# Altium schematic sheet [4] - DRIVERS.SchDoc: Control Board
size A4; CheckedBy: Rafael Lang; CompanyName: Gear Labs; DrawnBy: Pedro Neves; Organization: Gear Labs; DocumentNumber: 001/2017; Revision: v1.0; SheetNumber: 4; SheetTotal: 6
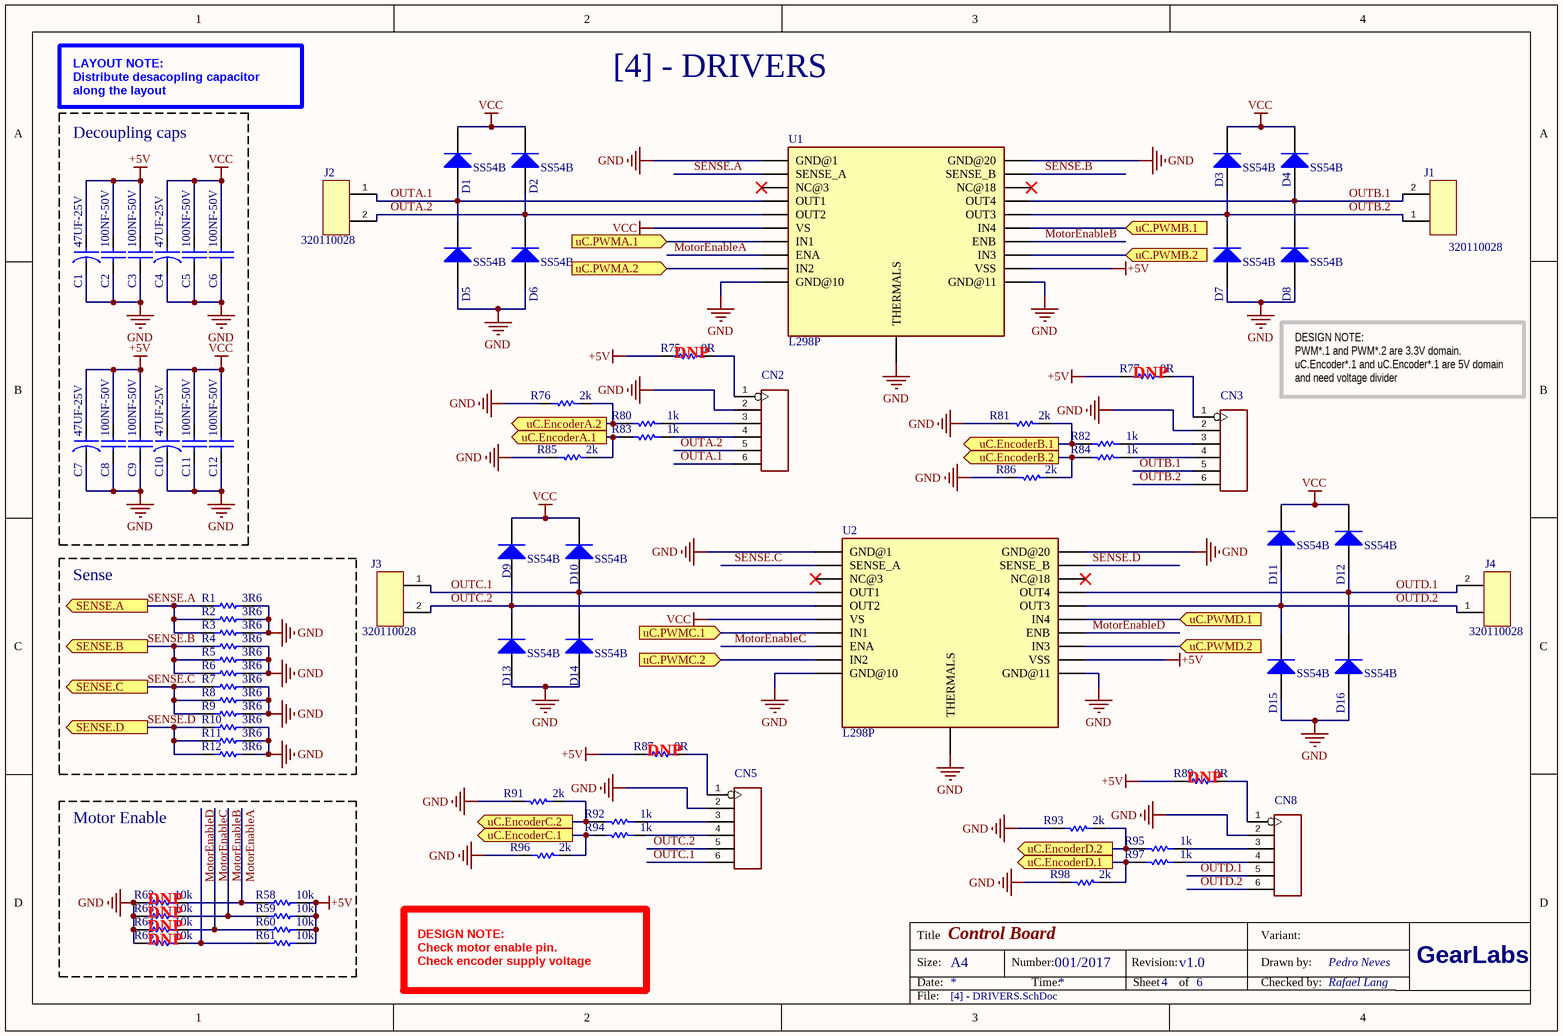
[diagram p0: [4] - DRIVERS.SchDoc]

## Parts
C1  value 47UF-25V  [ELECTRO-SMD-C-6MM]  (hidden comment: 302030059)
C2  value 100NF-50V  [C0603]  (hidden comment: 302010138)
C3  value 100NF-50V  [C0603]  (hidden comment: 302010138)
C4  value 47UF-25V  [ELECTRO-SMD-C-6MM]  (hidden comment: 302030059)
C5  value 100NF-50V  [C0603]  (hidden comment: 302010138)
C6  value 100NF-50V  [C0603]  (hidden comment: 302010138)
C7  value 47UF-25V  [ELECTRO-SMD-C-6MM]  (hidden comment: 302030059)
C8  value 100NF-50V  [C0603]  (hidden comment: 302010138)
C9  value 100NF-50V  [C0603]  (hidden comment: 302010138)
C10  value 47UF-25V  [ELECTRO-SMD-C-6MM]  (hidden comment: 302030059)
C11  value 100NF-50V  [C0603]  (hidden comment: 302010138)
C12  value 100NF-50V  [C0603]  (hidden comment: 302010138)
CN2  320030060  [H6-2.54]  (value not drawn)
CN3  320030060  [H6-2.54]  (value not drawn)
CN5  320030060  [H6-2.54]  (value not drawn)
CN8  320030060  [H6-2.54]  (value not drawn)
D1  MPN: SS54B  [DO-214AA]  (hidden comment: 304020021)
D2  MPN: SS54B  [DO-214AA]  (hidden comment: 304020021)
D3  MPN: SS54B  [DO-214AA]  (hidden comment: 304020021)
D4  MPN: SS54B  [DO-214AA]  (hidden comment: 304020021)
D5  MPN: SS54B  [DO-214AA]  (hidden comment: 304020021)
D6  MPN: SS54B  [DO-214AA]  (hidden comment: 304020021)
D7  MPN: SS54B  [DO-214AA]  (hidden comment: 304020021)
D8  MPN: SS54B  [DO-214AA]  (hidden comment: 304020021)
D9  MPN: SS54B  [DO-214AA]  (hidden comment: 304020021)
D10  MPN: SS54B  [DO-214AA]  (hidden comment: 304020021)
D11  MPN: SS54B  [DO-214AA]  (hidden comment: 304020021)
D12  MPN: SS54B  [DO-214AA]  (hidden comment: 304020021)
D13  MPN: SS54B  [DO-214AA]  (hidden comment: 304020021)
D14  MPN: SS54B  [DO-214AA]  (hidden comment: 304020021)
D15  MPN: SS54B  [DO-214AA]  (hidden comment: 304020021)
D16  MPN: SS54B  [DO-214AA]  (hidden comment: 304020021)
J1  320110028  [H2-3.5-7.0X7.0MM]
J2  320110028  [H2-3.5-7.0X7.0MM]
J3  320110028  [H2-3.5-7.0X7.0MM]
J4  320110028  [H2-3.5-7.0X7.0MM]
R1  value 3R6  [R0603]  (hidden comment: 301010140)
R2  value 3R6  [R0603]  (hidden comment: 301010140)
R3  value 3R6  [R0603]  (hidden comment: 301010140)
R4  value 3R6  [R0603]  (hidden comment: 301010140)
R5  value 3R6  [R0603]  (hidden comment: 301010140)
R6  value 3R6  [R0603]  (hidden comment: 301010140)
R7  value 3R6  [R0603]  (hidden comment: 301010140)
R8  value 3R6  [R0603]  (hidden comment: 301010140)
R9  value 3R6  [R0603]  (hidden comment: 301010140)
R10  value 3R6  [R0603]  (hidden comment: 301010140)
R11  value 3R6  [R0603]  (hidden comment: 301010140)
R12  value 3R6  [R0603]  (hidden comment: 301010140)
R58  value 10k  [R0603]  (hidden comment: 301010293)
R59  value 10k  [R0603]  (hidden comment: 301010293)
R60  value 10k  [R0603]  (hidden comment: 301010293)
R61  value 10k  [R0603]  (hidden comment: 301010293)
R62  value 10k  [R0603]  (hidden comment: 301010293)
R63  value 10k  [R0603]  (hidden comment: 301010293)
R64  value 10k  [R0603]  (hidden comment: 301010293)
R65  value 10k  [R0603]  (hidden comment: 301010293)
R75  value 0R  [R0603]  (hidden comment: 301010292)
R76  value 2k  [R0603]  (hidden comment: 301010221)
R77  value 0R  [R0603]  (hidden comment: 301010292)
R80  value 1k  [R0603]  (hidden comment: 301010298)
R81  value 2k  [R0603]  (hidden comment: 301010221)
R82  value 1k  [R0603]  (hidden comment: 301010298)
R83  value 1k  [R0603]  (hidden comment: 301010298)
R84  value 1k  [R0603]  (hidden comment: 301010298)
R85  value 2k  [R0603]  (hidden comment: 301010221)
R86  value 2k  [R0603]  (hidden comment: 301010221)
R87  value 0R  [R0603]  (hidden comment: 301010292)
R89  value 0R  [R0603]  (hidden comment: 301010292)
R91  value 2k  [R0603]  (hidden comment: 301010221)
R92  value 1k  [R0603]  (hidden comment: 301010298)
R93  value 2k  [R0603]  (hidden comment: 301010221)
R94  value 1k  [R0603]  (hidden comment: 301010298)
R95  value 1k  [R0603]  (hidden comment: 301010298)
R96  value 2k  [R0603]  (hidden comment: 301010221)
R97  value 1k  [R0603]  (hidden comment: 301010298)
R98  value 2k  [R0603]  (hidden comment: 301010221)
U1  L298P  [SOIC20G-1.27-16X11MM]
U2  L298P  [SOIC20G-1.27-16X11MM]

## Blocks framed on the sheet
Decoupling caps: C1-C12
Sense: R1-R12

## Ports
SENSE.A (out), SENSE.B (out), SENSE.C (out), SENSE.D (out), uC.EncoderA.1 (out), uC.EncoderA.2 (out), uC.EncoderB.1 (out), uC.EncoderB.2 (out), uC.EncoderC.1 (out), uC.EncoderC.2 (out), uC.EncoderD.1 (out), uC.EncoderD.2 (out), uC.PWMA.1 (in), uC.PWMA.2 (in), uC.PWMB.1 (in), uC.PWMB.2 (in), uC.PWMC.1 (in), uC.PWMC.2 (in), uC.PWMD.1 (in), uC.PWMD.2 (in)

## Nets
+5V: C1.+ C2.1 C3.1 C7.+ C8.1 C9.1 R58.2 R59.2 R60.2 R61.2 R75.1 R77.1 R87.1 R89.1 U1.12(VSS) U2.12(VSS)
GND: C1.- C2.2 C3.2 C4.- C5.2 C6.2 C7.- C8.2 C9.2 C10.- C11.2 C12.2 CN2.2 CN3.2 CN5.2 CN8.2 D5.+ D6.+ D7.+ D8.+ D13.+ D14.+ D15.+ D16.+ R1.2 R2.2 R3.2 R4.2 R5.2 R6.2 R7.2 R8.2 R9.2 R10.2 R11.2 R12.2 R62.1 R63.1 R64.1 R65.1 R76.1 R81.1 R85.1 R86.1 R91.1 R93.1 R96.1 R98.1 U1.1(GND@1) U1.10(GND@10) U1.11(GND@11) U1.20(GND@20) U1.THERMALS U2.1(GND@1) U2.10(GND@10) U2.11(GND@11) U2.20(GND@20) U2.THERMALS
VCC: C4.+ C5.1 C6.1 C10.+ C11.1 C12.1 D1.- D2.- D3.- D4.- D9.- D10.- D11.- D12.- U1.6(VS) U2.6(VS)
MotorEnableA: R58.1 R62.2 U1.8(ENA)
MotorEnableB: R59.1 R63.2 U1.14(ENB)
MotorEnableC: R60.1 R64.2 U2.8(ENA)
MotorEnableD: R61.1 R65.2 U2.14(ENB)
OUTA.1: CN2.6 D1.+ D5.- J2.1 U1.4(OUT1)
OUTA.2: CN2.5 D2.+ D6.- J2.2 U1.5(OUT2)
OUTB.1: CN3.5 D4.+ D8.- J1.2 U1.17(OUT4)
OUTB.2: CN3.6 D3.+ D7.- J1.1 U1.16(OUT3)
OUTC.1: CN5.6 D10.+ D14.- J3.1 U2.4(OUT1)
OUTC.2: CN5.5 D9.+ D13.- J3.2 U2.5(OUT2)
OUTD.1: CN8.5 D12.+ D16.- J4.2 U2.17(OUT4)
OUTD.2: CN8.6 D11.+ D15.- J4.1 U2.16(OUT3)
SENSE.A: R1.1 R2.1 R3.1 U1.2(SENSE_A) ; port SENSE.A
SENSE.B: R4.1 R5.1 R6.1 U1.19(SENSE_B) ; port SENSE.B
SENSE.C: R7.1 R8.1 R9.1 U2.2(SENSE_A) ; port SENSE.C
SENSE.D: R10.1 R11.1 R12.1 U2.19(SENSE_B) ; port SENSE.D
uC.EncoderA.1: R83.2 R85.2 ; port uC.EncoderA.1
uC.EncoderA.2: R76.2 R80.2 ; port uC.EncoderA.2
uC.EncoderB.1: R81.2 R82.2 ; port uC.EncoderB.1
uC.EncoderB.2: R84.2 R86.2 ; port uC.EncoderB.2
uC.EncoderC.1: R94.2 R96.2 ; port uC.EncoderC.1
uC.EncoderC.2: R91.2 R92.2 ; port uC.EncoderC.2
uC.EncoderD.1: R97.2 R98.2 ; port uC.EncoderD.1
uC.EncoderD.2: R93.2 R95.2 ; port uC.EncoderD.2
uC.PWMA.1: U1.7(IN1) ; port uC.PWMA.1
uC.PWMA.2: U1.9(IN2) ; port uC.PWMA.2
uC.PWMB.1: U1.15(IN4) ; port uC.PWMB.1
uC.PWMB.2: U1.13(IN3) ; port uC.PWMB.2
uC.PWMC.1: U2.7(IN1) ; port uC.PWMC.1
uC.PWMC.2: U2.9(IN2) ; port uC.PWMC.2
uC.PWMD.1: U2.15(IN4) ; port uC.PWMD.1
uC.PWMD.2: U2.13(IN3) ; port uC.PWMD.2
NetCN2_1: CN2.1 R75.2
NetCN2_3: CN2.3 R80.1
NetCN2_4: CN2.4 R83.1
NetCN3_1: CN3.1 R77.2
NetCN3_3: CN3.3 R82.1
NetCN3_4: CN3.4 R84.1
NetCN5_1: CN5.1 R87.2
NetCN5_3: CN5.3 R92.1
NetCN5_4: CN5.4 R94.1
NetCN8_1: CN8.1 R89.2
NetCN8_3: CN8.3 R95.1
NetCN8_4: CN8.4 R97.1

Not connected (* = marked no-connect by the designer): U1 3(NC@3)* 18(NC@18)*; U2 3(NC@3)* 18(NC@18)*

## Notes on the sheet
- LAYOUT NOTE:
  Distribute desacopling capacitor along the layout
- [4] - DRIVERS
- (near R75) DNP
- (near R77) DNP
- DESIGN NOTE:
  PWM*.1 and PWM*.2 are 3.3V domain.
  uC.Encoder*.1 and uC.Encoder*.1 are 5V domain and need voltage divider
- (near R87) DNP
- (near R89) DNP
- Motor Enable
- (near R62) DNP
- DNP
- DESIGN NOTE:
  Check motor enable pin.
  Check encoder supply voltage
- Title
- Size:
- Date:
- A4
- Number:
- Time:
- Revision:
- Sheet
- of
- Drawn by:
- Checked by:
- Variant:
- GearLabs
- File:

## Library data of the parts
C1 C4 C7 C10 = ALUMINUM-SMD-47UF-25V(D6.3-H5.3MM): MPN: CS1E470M-CRE54
C2 C3 C5 C6 C8 C9 C11 C12 = CERAMIC-100NF-50V-10%-X7R(0603): MPN: CC0603KRX7R9BB104
CN2 CN3 CN5 CN8 = DIP-BLACK-FEMALE-HEADER-VERT(6P-2.54): MPN: F185-1106A1BSYC1
D1-D16 = SMD-DIODE-SCHOTTKY-28V-5A(DO-214AA)
J1-J4 = SCREW-TERMINAL-GREEN(2P-3.5) - BORNE
R1-R12 = SMD-RES-3.6R-5%-1/10W(0603): MPN: RC0603JR-073R6L
R58-R65 = SMD-RES-10K-5%-1/10W(0603): MPN: RC0603JR-0710KL
R75 R77 R87 R89 = SMD-RES-0R-5%-1/10W(0603): MPN: RC0603JR-070RL
R76 R81 R85 R86 R91 R93 R96 R98 = SMD-RES-2K-1%-1/10W(0603): MPN: RC0603FR-072KL
R80 R82-R84 R92 R94 R95 R97 = SMD-RES-1K-1%-1/10W(0603): MPN: RC0603FR-071KL
U1 U2 = DRIVER-L298P(SOIC20): MPN: L298P